# EAGLE design sanfrancisco_barometer_rev_a (EAGLE 5.11)
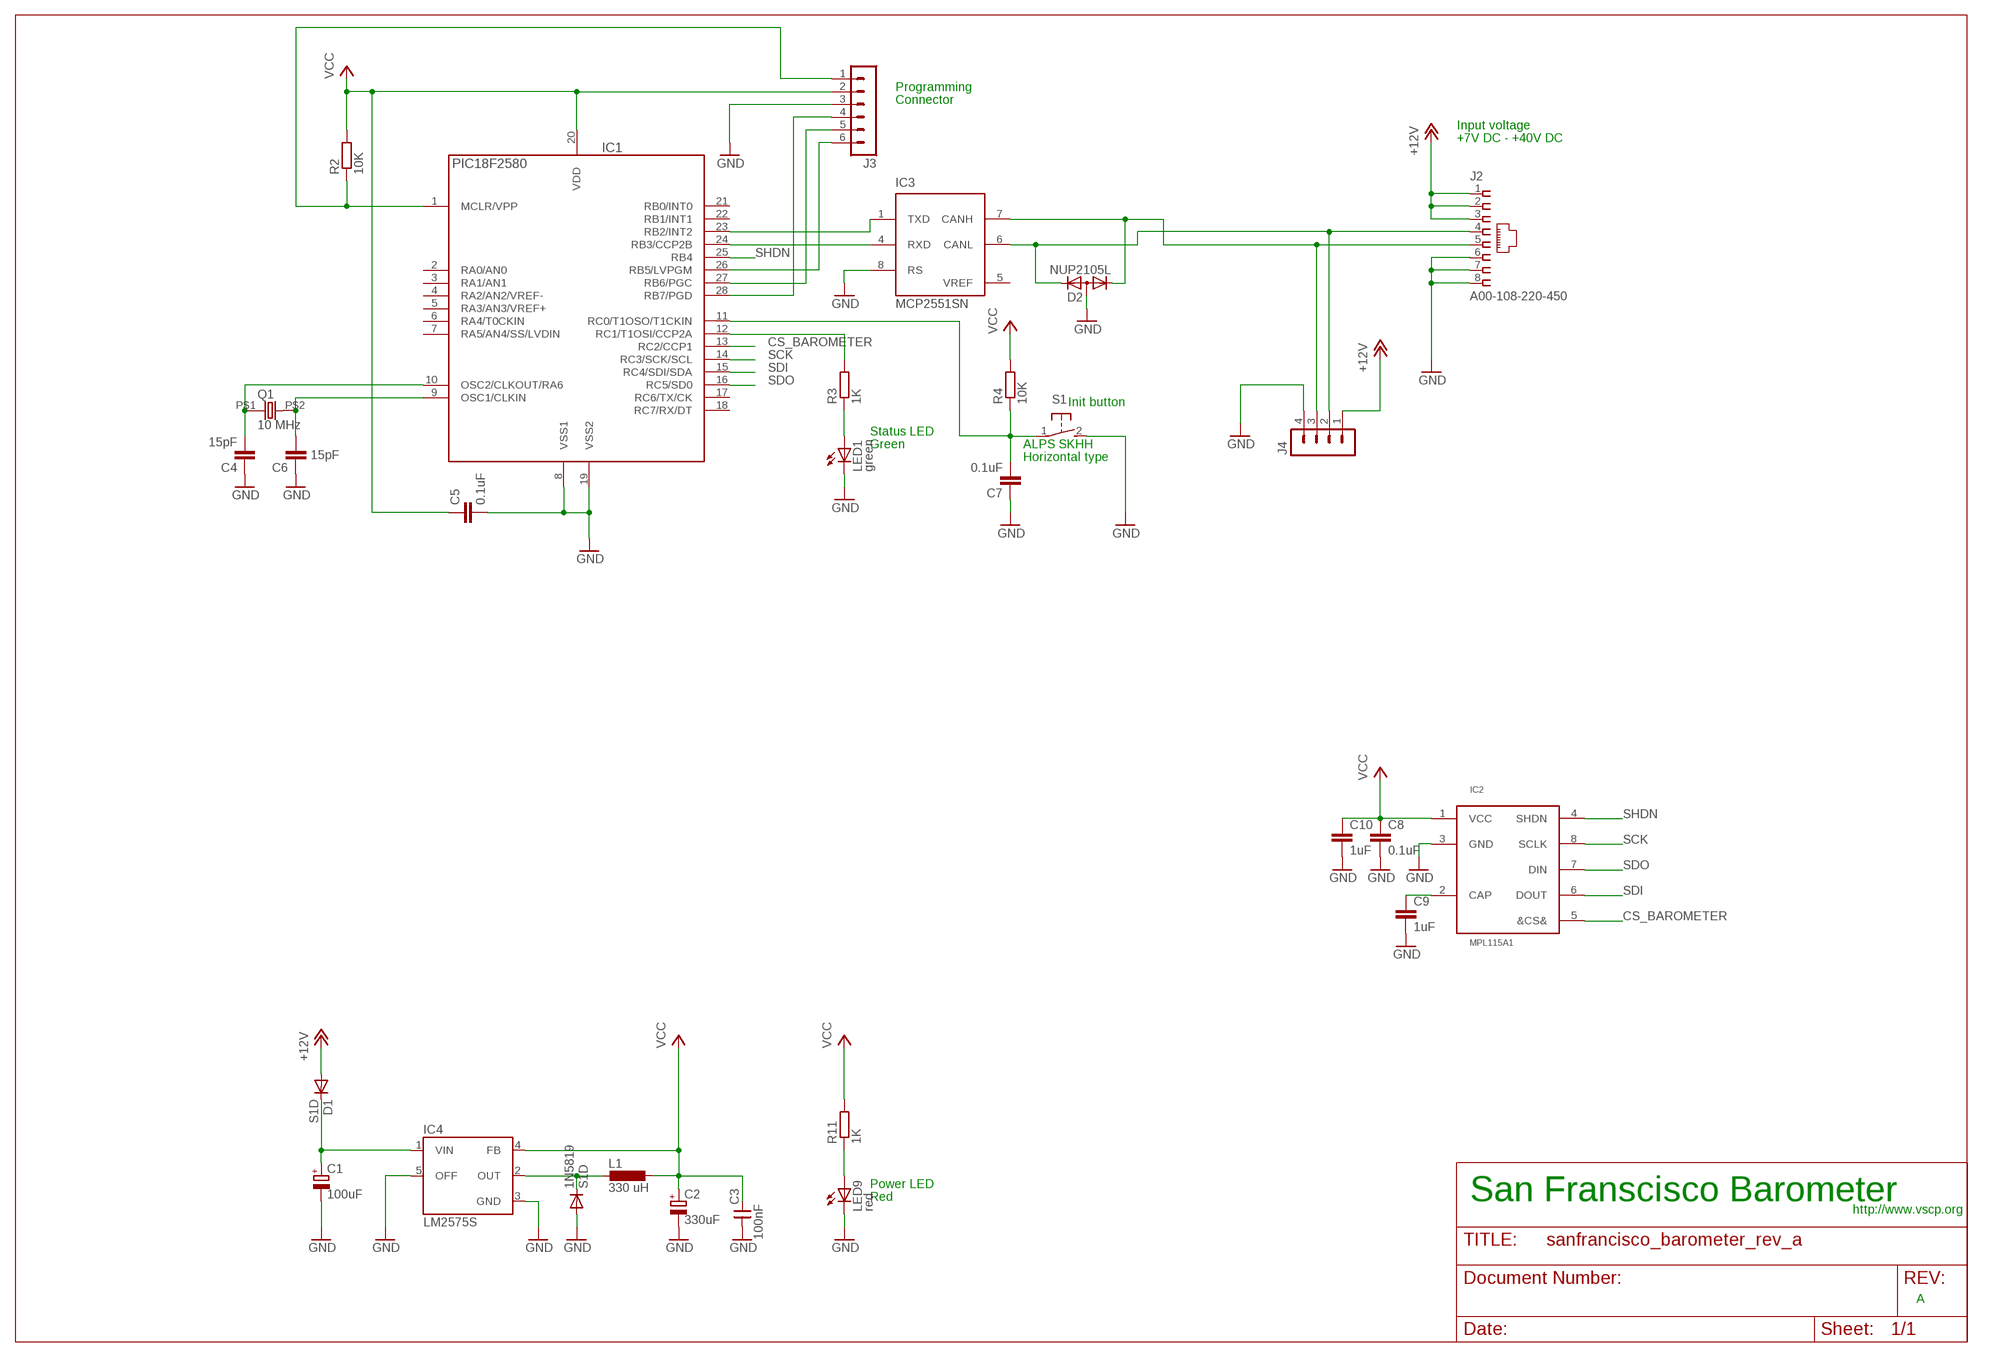
[diagram p0: schematic, sheet 1]

## Parts
1N5819  S1D  DIODE-SMB  [SMB]
C1  100uF  CPOL-EUD  [PANASONIC_D]
C2  330uF  CPOL-EUD  [PANASONIC_D]
C3  100nF  CNP-0805  [0805]
C4  15pF  C-EUC0805  [C0805]
C5  0.1uF  C-EUC0805  [C0805]
C6  15pF  C-EUC0805  [C0805]
C7  0.1uF  C-EUC0805  [C0805]
C8  0.1uF  C-EUC0805  [C0805]
C9  1uF  C-EUC0805  [C0805]
C10  1uF  C-EUC0805  [C0805]
D1  S1D  DIODE-SMB  [SMB]
D2  NUP2105L  DIODE-2CA|ACSOT23  [SOT23]
IC1  PIC18F2580  PIC18LF252-I/SO  [SO28]
IC2  MPL115A1  [LGA8]
IC3  MCP2551SN  [SO-08]
IC4  LM2575S  [TO263-5]
J2  A00-108-220-450  [RJ-45]
J3  MA06-1  [MA06-1]
J4  MA04-1  [MA04-1]
L1  330 uH  DO3316P  [DO3316P]
LED1  green  LEDCHIP-LED0805  [CHIP-LED0805]
LED9  red  LEDCHIP-LED0805  [CHIP-LED0805]
Q1  10 MHz  HC-49S  [9C]
R2  10K  R-EU_R0805  [R0805]
R3  1K  R-EU_R0805  [R0805]
R4  10K  R-EU_R0805  [R0805]
R11  1K  R-EU_R0805  [R0805]
S1  31-XX  [B3F-31XX]

## Nets
+12V: D1.A J2.1 J2.2 J2.3 J4.1
CANH: D2.1(K1) IC3.7(CANH) J2.5 J4.3
CANL: D2.2(K2) IC3.6(CANL) J2.4 J4.2
CS_BAROMETER: IC1.13(RC2/CCP1) IC2.5(&CS&)
GND: 1N5819.A C1.- C2.- C3.1 C4.1 C5.2 C6.1 C7.1 C8.2 C9.2 C10.2 D2.3(A) IC1.8(VSS1) IC1.19(VSS2) IC2.3(GND) IC3.8(RS) IC4.3(GND) IC4.5(OFF) J2.6 J2.7 J2.8 J3.3 J4.4 LED1.C LED9.C S1.2(S)
N$1: 1N5819.C IC4.2(OUT) L1.1
N$2: C4.2 IC1.10(OSC2/CLKOUT/RA6) Q1.P$1
N$3: C1.+ D1.C IC4.1(VIN)
N$4: IC1.12(RC1/T1OSI/CCP2A) R3.2
N$5: LED1.A R3.1
N$6: C7.2 IC1.11(RC0/T1OSO/T1CKIN) R4.1 S1.1(P)
N$7: C6.2 IC1.9(OSC1/CLKIN) Q1.P$2
N$9: C9.1 IC2.2(CAP)
N$12: IC1.1(MCLR/VPP) J3.1 R2.1
N$13: IC1.28(RB7/PGD) J3.4
N$14: IC1.27(RB6/PGC) J3.5
N$15: IC1.26(RB5/LVPGM) J3.6
N$20: LED9.A R11.1
RXCAN: IC1.24(RB3/CCP2B) IC3.4(RXD)
SCK: IC1.14(RC3/SCK/SCL) IC2.8(SCLK)
SDI: IC1.15(RC4/SDI/SDA) IC2.6(DOUT)
SDO: IC1.16(RC5/SD0) IC2.7(DIN)
SHDN: IC1.25(RB4) IC2.4(SHDN)
TXCAN: IC1.23(RB2/INT2) IC3.1(TXD)
VCC: C2.+ C3.2 C5.1 C8.1 C10.1 IC1.20(VDD) IC2.1(VCC) IC4.4(FB) J3.2 L1.2 R2.2 R4.2 R11.2
Unconnected: IC1.2(RA0/AN0) IC1.3(RA1/AN1) IC1.4(RA2/AN2/VREF-) IC1.5(RA3/AN3/VREF+) IC1.6(RA4/T0CKIN) IC1.7(RA5/AN4/SS/LVDIN) IC1.17(RC6/TX/CK) IC1.18(RC7/RX/DT) IC1.21(RB0/INT0) IC1.22(RB1/INT1)

## Notes on the sheet
- Programming
- Connector
- Input voltage
- +7V DC - +40V DC
- Init button
- Status LED
- Green | ALPS SKHH
- Horizontal type
- Power LED
- Red | San Franscisco Barometer
- http://www.vscp.org
- A

## Power pins joined to a net without a drawn wire
GND: IC3.2(VSS)
VCC: IC3.3(VDD)
VREF: IC3.5(VREF)

## Library data of the parts
1N5819 D1 = diode:DIODE-: DIODE
C1 C2 = rcl:CPOL-EU: POLARIZED CAPACITOR, European symbol
C3 = cap-master:CNP-: NON-POLARIZED CAP
C4-C10 = rcl:C-EU: CAPACITOR, European symbol
D2 = diode:DIODE-2CA|AC: Dual DIODE Cathode-Anode|Anode-Cathode
IC1 = pic_olin:PIC18*F252-?: 18F252, 28 pin, 32Kb prog, 1536 data, 256 EEPROM
IC2 = mpl115a1:MPL115A1
IC3 = microchip_can:MCP2551: High Speed CAN tranceiver
IC4 = v-reg-3:LM2575: National Semiconductor <http://www.national.com> 1.0A "Simple Switcher"(c) 52kHz, Vout 1.23-37V (HV: 57V), Vin 40V (HV: 60V), 50µA standby current
J2 = vscpcan:A00-108-220-450
J3 = con-lstb:MA06-1: PIN HEADER; OC_FARNELL: unknown; OC_NEWARK: unknown
J4 = con-lstb:MA04-1: PIN HEADER; OC_FARNELL: unknown; OC_NEWARK: unknown
L1 = inductor-coilcraft:DO3316P: COILCRAFT; OC_FARNELL: unknown; OC_NEWARK: unknown
LED1 LED9 = led:LED: LED OSRAM: - CHIPLED LG R971, LG N971, LY N971, LG Q971, LY Q971, LO R971, LY R971 LH N974, LH R974 LS Q976, LO Q976, LY Q976 LO Q996 - Hyper CHIPLED LW Q18S LB Q993, LB Q99A, LB R99A - SideLED LS A670, LO A670, LY A670, LG A670, LP A670 LB A673, LV A673, LT A673, LW A673 LH A674 LY A675 LS A676, LA A676, LO A676, LY A676, LW A676 LS A679, LY A679, LG A679 - Hyper Micro SIDELED® LS Y876, LA Y876, LO Y876, LY Y876 LT Y87S - SmartLED LW L88C, LW L88S LB L89C, LB L89S, LG L890 LS L89K, LO L89K, LY L89K LS L896, LA L896, LO L896, LY L896 - TOPLED LS T670, LO T670, LY T670, LG T670, LP T670 LSG T670, LSP T670, LSY T670, LOP T670, LYG T670 LG T671, LOG T671, LSG T671 LB T673, LV T673, LT T673, LW T673 LH T674 LS T676, LA T676, LO T676, LY T676, LB T676, LH T676, LSB T676, LW T676 LB T67C, LV T67C, LT T67C, LS T67K, LO T67K, LY T67K, LW E67C LS E67B, LA E67B, LO E67B, LY E67B, LB E67C, LV E67C, LT E67C LW T67C LS T679, LY T679, LG T679 LS T770, LO T770, LY T770, LG T770, LP T770 LB T773, LV T773, LT T773, LW T773 LH T774 LS E675, LA E675, LY E675, LS T675 LS T776, LA T776, LO T776, LY T776, LB T776 LHGB T686 LT T68C, LB T68C - Hyper Mini TOPLED® LB M676 - Mini TOPLED Santana® LG M470 LS M47K, LO M47K, LY M47K Source: http://www.osram.convergy.de LUXEON: - LUMILED® LXK2-PW12-R00, LXK2-PW12-S00, LXK2-PW14-U00, LXK2-PW14-V00 LXK2-PM12-R00, LXK2-PM12-S00, LXK2-PM14-U00 LXK2-PE12-Q00, LXK2-PE12-R00, LXK2-PE12-S00, LXK2-PE14-T00, LXK2-PE14-U00 LXK2-PB12-K00, LXK2-PB12-L00, LXK2-PB12-M00, LXK2-PB14-N00, LXK2-PB14-P00, LXK2-PB14-Q00 LXK2-PR12-L00, LXK2-PR12-M00, LXK2-PR14-Q00, LXK2-PR14-R00 LXK2-PD12-Q00, LXK2-PD12-R00, LXK2-PD12-S00 LXK2-PH12-R00, LXK2-PH12-S00 LXK2-PL12-P00, LXK2-PL12-Q00, LXK2-PL12-R00 Source: www.luxeon.com KINGBRIGHT: KA-3528ASYC Source: www.kingbright.com
Q1 = vscpcan:HC-49S: Digikey 887-1050-1-nd
R2-R4 R11 = rcl:R-EU_: RESISTOR, European symbol
S1 = switch-omron:31-XX: OMRON SWITCH; MPN: B3F-3100; OC_FARNELL: 959704; OC_NEWARK: 36M3582

## Board
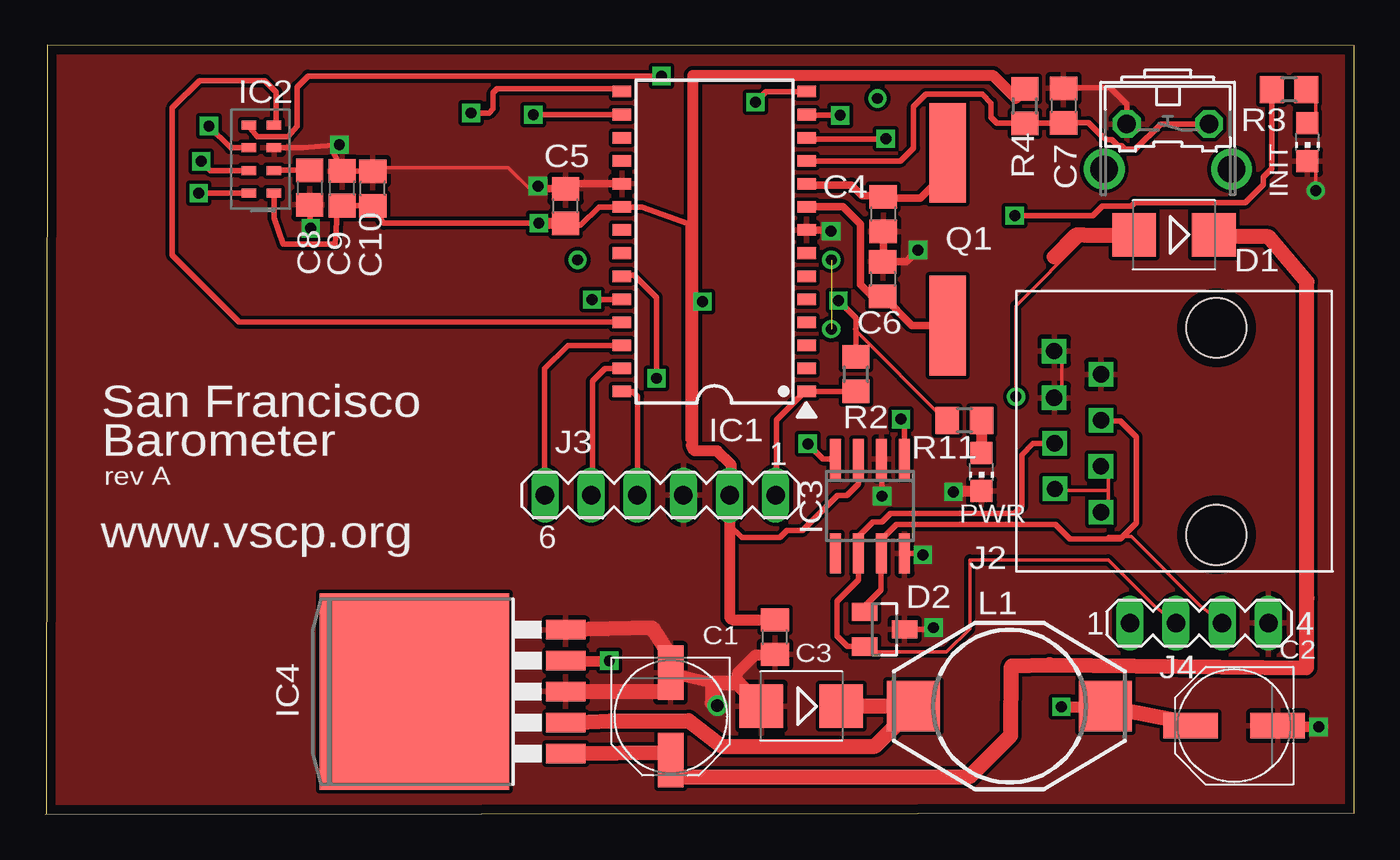
[diagram p1: board, top side]
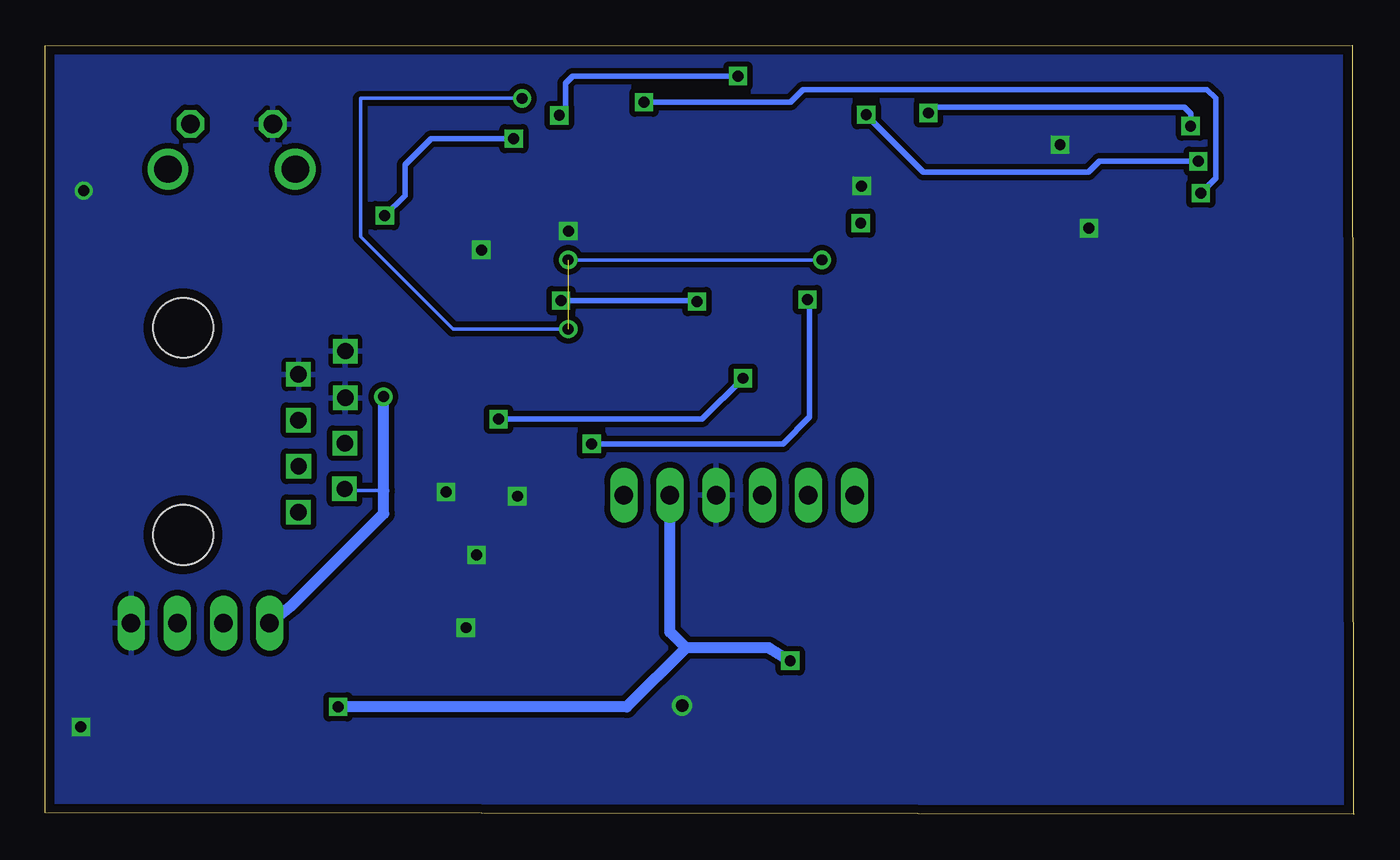
[diagram p2: board, bottom side, seen from below]

Size 72.04 x 42.34 mm. Coordinates in mm from the lower left corner, seen from the top.
Outline: 0,0 72.04,0.09 72.04,42.31 0.09,42.34 0.04,0.01
Copper layers (1*16): Top 0.035mm / dielectric 1.5mm / Bottom 0.035mm
Design rules "8mils": minimum track width 8mil, minimum drill 0.6mm, track to track 8mil, track to pad 8mil, pad to pad 8mil, via to via 8mil, smd to smd 0mil, copper to edge 20mil, drill to drill 10mil, minimum pad ring 8mil, minimum via ring 8mil, stop-mask expansion 0mil, vias tented up to drill 0mil, thermal gap 10mil

### Footprints (pad centres in the part's own frame; a part is rotated, then mirrored left to right if it is on the bottom)
SMB = smd 2.4 x 2.4: A 2.2,0; C -2.2,0
PANASONIC_D = smd 3 x 1.4: + 2.4,0; - -2.4,0
0805 = smd 1.27 x 1.524: 1 -0.953,0; 2 0.953,0
C0805 = smd 1.3 x 1.5: 1 -0.95,0; 2 0.95,0
SOT23 = smd 1 x 1.4: 1 -0.95,-1.1; 2 0.95,-1.1; 3 0,1.1
SO28 = smd 0.635 x 1.016: 1 -8.255,-5.08; 2 -6.985,-5.08; 3 -5.715,-5.08; 4 -4.445,-5.08; 5 -3.175,-5.08; 6 -1.905,-5.08; 7 -0.635,-5.08; 8 0.635,-5.08; 9 1.905,-5.08; 10 3.175,-5.08; 11 4.445,-5.08; 12 5.715,-5.08; 13 6.985,-5.08; 14 8.255,-5.08; 15 8.255,5.08; 16 6.985,5.08; 17 5.715,5.08; 18 4.445,5.08; 19 3.175,5.08; 20 1.905,5.08; 21 0.635,5.08; 22 -0.635,5.08; 23 -1.905,5.08; 24 -3.175,5.08; 25 -4.445,5.08; 26 -5.715,5.08; 27 -6.985,5.08; 28 -8.255,5.08
LGA8 = smd 0.8 x 0.5: 1 0,1.875; 2 0,0.625; 3 0,-0.625; 4 0,-1.875; 5 1.4,-1.875; 6 1.4,-0.625; 7 1.4,0.625; 8 1.4,1.875
SO-08 = smd 0.6 x 2.2: 1 -1.905,-2.6; 2 -0.635,-2.6; 3 0.635,-2.6; 4 1.905,-2.6; 5 1.905,2.6; 6 0.635,2.6; 7 -0.635,2.6; 8 -1.905,2.6
TO263-5 = smd 1.067 x 2.159: 1 -3.404,-5.791; 2 -1.702,-5.791; 3 0,-5.791; 4 1.702,-5.791; 5 3.404,-5.791 | smd 10.8 x 10.41: 6 0,2.54
RJ-45 = drill 0.9 square: 1 -4.45,6.35; 2 -3.17,8.89; 3 -1.92,6.36; 4 -0.65,8.91; 5 0.62,6.35; 6 1.84,8.93; 7 3.14,6.35; 8 4.42,8.93 | hole 3.3: -5.7,0; 5.7,0
MA06-1 = drill 1.016 long: 1 -6.35,0; 2 -3.81,0; 3 -1.27,0; 4 1.27,0; 5 3.81,0; 6 6.35,0
MA04-1 = drill 1.016 long: 1 -3.81,0; 2 -1.27,0; 3 1.27,0; 4 3.81,0
DO3316P = smd 2.92 x 2.79: 1 -5.28,0; 2 5.28,0
CHIP-LED0805 = smd 1.2 x 1.2: A 0,-1.05; C 0,1.05
9C = smd 5.5 x 2: P$1 -4.74,0; P$2 4.76,0
R0805 = smd 1.3 x 1.5: 1 -0.95,0; 2 0.95,0
B3F-31XX = drill 1.016 octagon: 1 -2.261,-1.245; 2 2.261,-1.245 | drill 1.499 pad 2.159 round: 3 -3.505,1.245; 4 3.505,1.245

### Placement (x,y rotation side)
1N5819  41.61,5.96 180 top
C1  34.42,5.39 270 top
C2  65.44,4.89 180 top
C3  40.16,9.76 90 top
C4  46.12,33.05 90 top
C5  28.63,33.49 90 top
C6  46.09,29.48 270 top
C7  56.05,39.02 270 top
C8  16.34,34.47 90 top
C9  14.55,34.51 270 top
C10  18.02,34.46 90 top
D1  62.12,31.91 180 top
D2  46.2,10.19 270 top
IC1  36.82,31.54 90 top
IC2  12.59,36.08 180 top
IC3  45.39,16.98 180 top
IC4  22.85,6.76 90 top
J2  64.46,21.09 90 top
J3  33.85,17.58 180 top
J4  63.51,10.53 0 top
L1  53.07,5.96 0 top
LED1  69.47,37.01 180 top
LED9  51.53,18.85 180 top
Q1  49.66,31.68 270 top
R2  44.62,24.24 90 top
R3  68.46,39.9 180 top
R4  53.92,39 90 top
R11  50.59,21.69 180 top
S1  61.79,36.77 180 top

### Tracks (layer width: path | path; a pad name or v marks a point on that pad's centre or on a via)
+12V  (via drill 0.6)
  Top 0.203: 58.5,17.83 55.96,17.83 J2.2 | 58.5,17.83 58.5,19.1 J2.3 | 58.5,17.83 58.5,16.56 J2.1 | v53.43,23 53.42,27.99 57.23,31.8 57.23,31.89
  Top 0.406: 59.9,31.89 D1.A
  Top 0.813: 55.53,30.71 56.71,31.89 57.23,31.89 59.9,31.89
  Bottom 0.203: 53.42,17.83 55.96,17.83 J2.2
  Bottom 0.61: v53.44,23 v53.43,23 53.42,17.83 53.42,16.56 58.5,11.48 J4.1
CANH
  Top 0.203: J4.3 63.58,11.48 59.77,15.29 58.5,15.29 58.5,15.17
  Top 0.305: D2.1 45.1,11.47 46,12.37 46,14.36 IC3.7 46.02,15.14 46.85,15.96 55.6,15.96 56.39,15.17 58.5,15.17 59.16,15.17 60.04,16.05 60.04,20.78 59.16,21.66 58.16,21.66 J2.5
CANL
  Top 0.203: J4.2 61.04,11.48 58.5,14.02 50.88,14.02 50.88,10.21 49.61,8.94 44.53,8.94 D2.2
  Top 0.305: D2.2 44.15,9.24 43.56,9.83 43.56,11.72 44.76,12.92 IC3.6 44.75,15.31 45.54,16.09 46.04,16.09 46.52,16.57 53.35,16.57 53.75,16.97 53.75,19.8 54.37,20.42 55.53,20.42 J2.4
CS_BAROMETER  (via drill 0.6)
  Top 0.305: IC2.5 11.19,37.89 11.66,37.32 13.37,37.32 13.85,37.9 13.85,40.04 14.46,40.65 v33.92,40.65 | v43.75,38.49 41.93,38.49 IC1.13
  Bottom 0.305: v33.92,40.65 43.02,40.65 43.4,40.27 43.4,38.84 v43.75,38.49
GND  (via drill 0.6, 0.7)
  Top 0.203: v69.93,34.34 69.93,35.61 LED1.C | J2.6 55.96,22.91 55.96,25.45 J2.8 | C10.2 17.86,35.61 25.48,35.61 26.75,34.34 v27.11,34.6
  Top 0.254: 36.71,7.23 36.71,7.41
  Top 0.305: D2.3 48.8,10.19 v48.89,10.28 | IC3.8 48.22,14.38 v48.31,14.29 | v46.06,17.52 46.06,19.55 IC3.2 | S1.2 59.53,39.11 58.63,40.01 56.09,40.01 C7.1 | IC2.3 14.17,36.7 v16.18,36.88 15.9,36.39 C8.2 15.96,35.41 C10.2 | C9.2 14.59,32.23 v14.6,32.27
  Top 0.406: IC1.19 28.9,34.71 C5.2 27.27,34.44 v27.11,34.6 | 46.05,32.17 C4.1 46.12,30.46 C6.1 47.39,30.43 v48.04,31.08 | IC1.8 43.18,32.17 v43.25,32.11
  Top 0.61: 34.73,6.77 34.41,6.7 34.7,7.26 34.73,7.23 | 34.73,7.23 34.78,7.18 | 34.73,7.23 C1.- | 39.5,5.83 39.41,5.93 1N5819.A 39.55,5.96 | C1.- 36.71,7.23 | 39.55,5.96 39.66,5.86 | 39.55,5.96 39.01,6.51 | 34.52,7.2 34.42,7.1 | C1.- 34.52,7.2 | 34.55,8.5 34.55,7.23 34.52,7.2 | 36.71,6.14 v36.99,5.99 | C2.- 70.21,4.83 | 38.1,7.23 38.1,7.79 39.09,8.78 40.13,8.78 C3.1 | LED9.C 50.03,17.8 v49.98,17.75
  Top 0.813: IC4.3 34.73,6.77 | 39.41,5.93 38.1,7.23 36.71,7.23 36.71,6.14 | IC4.5 33.42,10.26 34.55,8.5 | 70.21,4.83 v70.09,4.81
  pour Bottom (isolate 0.305): -0.22,1.63 1.44,-1.72 71.42,-2.09 73.46,1.28 73.18,34.45 71.6,43.71 0.21,43.61 -0.71,34.03
  pour Top: 0.73,41.31 0.72,0.05 71.52,0.78 71.52,1.18 70.95,1.18 70.95,41.48 32.25,41.48 32.25,41.08
  pour Top: -0.72,42.85 -0.72,-1.38 73,-1.38 73,43.09
N$1
  Top 0.61: 47.91,5.91 47.86,5.96 L1.1 47.79,5.86 | IC4.2 28.73,5 28.61,4.94
  Top 0.813: L1.1 1N5819.C | 47.79,5.86 45.68,3.75 37.24,3.75 35.43,5.16 31.1,5.15 28.69,5.05 28.73,5
N$2
  Top 0.406: Q1.P$1 49.66,35.42 48.18,33.94 45.74,33.94 45.6,34.08 | 45.6,34.08 46.04,34.08 C4.2 | 45.6,34.08 44.95,34.08 44.38,34.65 41.96,34.65 IC1.10
N$3
  Top 0.406: 34.43,3.41 C1.+ 34.87,2.08 | D1.C 64.56,31.91 64.66,31.81
  Top 0.813: IC4.1 34.43,3.41 | 64.66,31.81 67.33,31.81 69.44,29.32 69.44,11.91 69.43,8.07 55.27,8.24 53.18,8.17 53.14,4.35 50.87,2.08 34.87,2.08
N$4  (via drill 0.6)
  Top 0.305: IC1.12 42,37.25 42.09,37.17 46.22,37.17 v46.26,37.21 | v53.36,32.97 57.66,32.97 58.18,33.49 59.77,33.49 59.97,33.69 66.06,33.69 67.04,34.67 67.04,35.09 67.51,35.56 R3.2
  Bottom 0.305: v46.26,37.21 50.81,37.21 52.25,35.77 52.25,34.08 v53.36,32.97
N$5
  Top 0.203: 69.93,39.42 69.93,38.15 LED1.A
  Top 0.254: 69.93,39.42 R3.1
N$6
  Top 0.305: IC1.11 41.91,35.97 47.07,35.97 47.79,36.69 47.79,38.97 48.47,39.65 51.57,39.65 52.06,39.16 52.06,38.38 52.39,38.05 R4.1 56.03,38.05 C7.2 56.07,38.09 57.4,38.09 58.15,37.34 58.21,37.34 58.41,37.14 58.7,37.14 59.03,36.81 59.22,36.81 59.41,36.62 60,36.62 61.39,38.02 S1.1
N$7
  Top 0.406: Q1.P$2 47.7,26.92 C6.2 45.49,28.53 44.86,29.16 44.86,32.5 43.91,33.45 IC1.9
N$9
  Top 0.305: C9.1 IC2.2
N$12
  Top 0.305: IC1.1 R2.1 41.82,23.29 40.24,21.71 40.24,17.62 J3.1
N$13
  Top 0.305: IC1.28 32.32,23.29 32.6,23.01 32.6,17.6 J3.4
N$14
  Top 0.305: IC1.27 30.81,24.55 30.11,23.85 30.11,17.65 J3.5
N$15
  Top 0.305: IC1.26 28.76,25.82 27.49,24.55 J3.6
N$20
  Top 0.61: R11.1 LED9.A
N$21  (via drill 0.6)  (1 unrouted)
  Bottom 0.203: v43.26,26.72 49.61,26.72 54.69,31.8 54.69,39.42 v45.8,39.42 | v29.29,30.53 v43.26,30.53
RXCAN  (via drill 0.6)
  Top 0.305: IC3.4 42.79,19.58 v41.97,20.4 | v30.09,28.35 31.72,28.35 IC1.24
  Bottom 0.305: v41.97,20.4 31.45,20.4 29.98,21.87 29.98,28.24 v30.09,28.35
SCK  (via drill 0.6)
  Top 0.305: IC1.14 39.67,39.79 v39.09,39.21 | v8.44,34.2 IC2.8
  Bottom 0.305: v39.09,39.21 31.02,39.21 30.33,39.9 8.1,39.9 7.62,39.42 7.62,35.02 v8.44,34.2
SDI  (via drill 0.6)
  Top 0.305: IC2.6 10.2,36.7 v9,37.9 | v23.43,38.62 24.41,38.62 24.65,38.86 24.65,39.73 24.87,39.95 31.58,39.95 IC1.15
  Bottom 0.305: v9,37.9 9,38.59 9.35,38.94 23.11,38.94 v23.43,38.62
SDO  (via drill 0.6)
  Top 0.305: IC2.7 9.07,35.45 v8.57,35.96 | v26.86,38.52 IC1.16
  Bottom 0.305: v8.57,35.96 14.03,35.96 14.62,35.37 23.71,35.37 v26.86,38.52
SHDN
  Top 0.305: IC1.25 10.68,27.1 6.98,30.79 6.98,38.9 8.49,40.41 12.06,40.41 12.7,39.77 12.7,38.06 IC2.4
TXCAN  (via drill 0.6)
  Top 0.305: IC3.1 47.3,21.55 v47.09,21.76 | v33.64,24.01 33.64,28.46 32.4,29.7 31.8,29.7 IC1.23
  Bottom 0.305: v47.09,21.76 35.89,21.76 v33.64,24.01
VCC  (via drill 0.6)
  Top 0.203: R11.2 49.61,21.64 44.53,26.72 44.62,26.72
  Top 0.254: 35.56,20.32 35.64,20.37
  Top 0.305: C5.1 28.73,32.44 29.46,32.44 30.46,33.45 IC1.20 32.84,33.45 35.38,32.53 35.38,28.13 | 35.38,28.13 35.38,20.63 35.56,20.32 | J3.2 37.76,17.68 | 30.94,8.41 v31.04,8.46 | IC3.3 44.75,18.2 44.11,17.55 43.59,17.55 41.67,15.63 40.82,15.63 40.43,15.24 38.34,15.24 37.66,15.92 | 58.3,5.92 L1.2 | R2.2 44.62,26.72 44.62,27.33 v43.66,28.29 | v36.17,28.24 35.49,28.24 35.38,28.13 | IC2.1 12.59,32.82 13.08,31.41 15.95,31.41 16.03,32.63 16.03,33.44 C8.1 17.66,33.52 C10.1 18.63,32.55 v27.16,32.55
  Top 0.406: 63.13,5 C2.+
  Top 0.61: 35.56,20.32 35.74,20.01 36.98,20.01 37.76,19.23 37.76,17.68 | IC4.4 30.94,8.41 | C3.2 37.8,10.71 37.66,10.85 37.66,15.92 J3.2 | C5.1 v27.17,32.54 v27.16,32.55 | v55.93,5.92 58.3,5.92 | 35.64,20.37 35.64,40.69 52.15,40.69 53.42,39.42 R4.2
  Top 0.813: L1.2 63.13,5
  Bottom 0.305: v43.66,28.29 36.22,28.29 v36.17,28.24
  Bottom 0.61: J3.2 37.66,10.04 36.79,9.17 | 36.79,9.17 32.22,9.17 v31.04,8.46 | v55.93,5.92 40.04,5.92 36.79,9.17

### Text on the board
tNames: INIT | San Francisco | Barometer | rev A | PWR | www.vscp.org